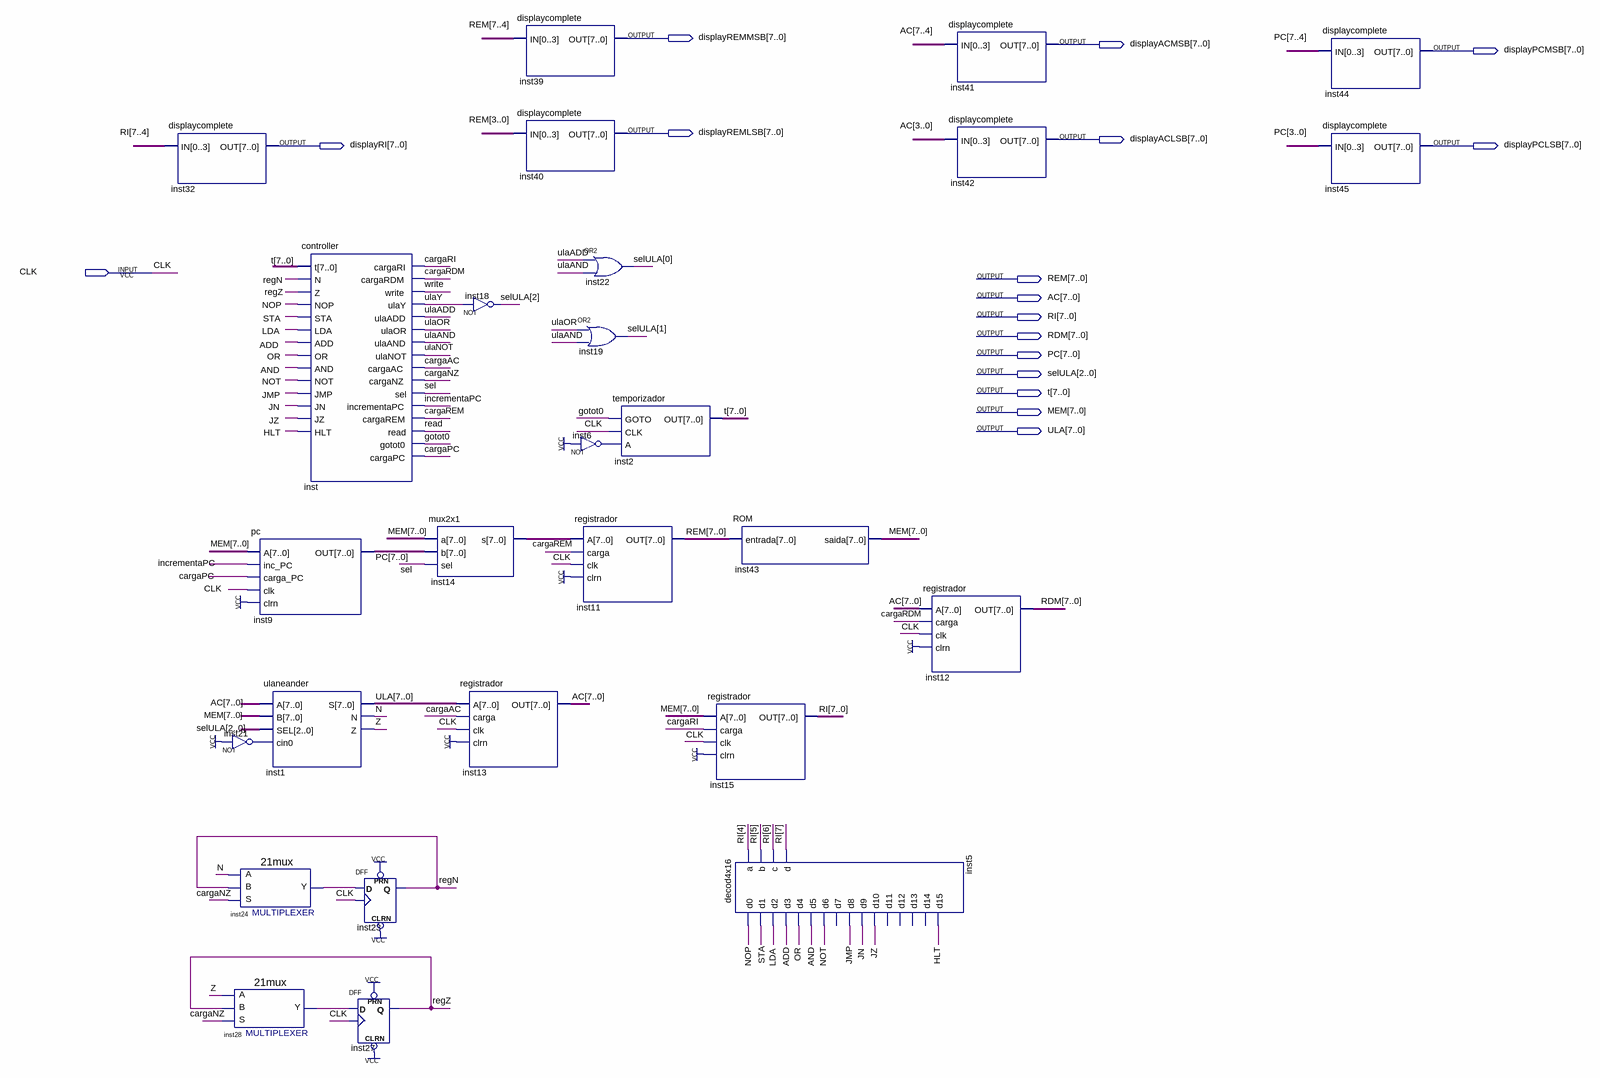
[diagram p0: schematic sheet]
// Quartus schematic neander.bdf as structural Verilog: 27 symbols, 17 pins
module neander (
  input  CLK,
  output [7:0] displayREMMSB,
  output [7:0] displayACMSB,
  output [7:0] displayPCMSB,
  output [7:0] displayREMLSB,
  output [7:0] displayACLSB,
  output [7:0] displayRI,
  output [7:0] displayPCLSB,
  output [7:0] REM,
  output [7:0] AC,
  output [7:0] RI,
  output [7:0] RDM,
  output [7:0] PC,
  output [2:0] selULA,
  output [7:0] t,
  output [7:0] MEM,
  output [7:0] ULA
);

  wire ADD, AND, cargaAC, cargaNZ, cargaPC, cargaRDM, cargaREM, cargaRI, gotot0, HLT, incrementaPC,
       inst6_out, inst21_out, inst24_y, inst28_y, JMP, JN, JZ, LDA, N, NOP, NOT, OR, read, regN, regZ, sel,
       STA, ulaADD, ulaAND, ulaNOT, ulaOR, ulaY, write, Z;
  wire [7:0] inst14_s;

  displaycomplete inst32 (.IN(RI[7:4]), .OUT(displayRI));
  pc inst9 (.A(MEM), .inc_PC(incrementaPC), .carga_PC(cargaPC), .clk(CLK), .clrn(1'b1), .OUT(PC));
  not inst21 (inst21_out, 1'b1);
  \21mux  inst24 (.S(cargaNZ), .B(regN), .A(N), .Y(inst24_y));
  \21mux  inst28 (.S(cargaNZ), .B(regZ), .A(Z), .Y(inst28_y));
  controller inst (
    .t(t), .N(regN), .Z(regZ), .NOP(NOP), .STA(STA), .LDA(LDA), .ADD(ADD), .OR(OR), .AND(AND), .NOT(NOT),
    .JMP(JMP), .JN(JN), .JZ(JZ), .HLT(HLT), .cargaRI(cargaRI), .cargaRDM(cargaRDM), .write(write),
    .ulaY(ulaY), .ulaADD(ulaADD), .ulaOR(ulaOR), .ulaAND(ulaAND), .ulaNOT(ulaNOT), .cargaAC(cargaAC),
    .cargaNZ(cargaNZ), .sel(sel), .incrementaPC(incrementaPC), .cargaREM(cargaREM), .read(read),
    .gotot0(gotot0), .cargaPC(cargaPC));
  ulaneander inst1 (.A(AC), .B(MEM), .SEL(selULA), .cin0(inst21_out), .S(ULA), .N(N), .Z(Z));
  DFF inst27 (.CLRN(1'b1), .CLK(CLK), .D(inst28_y), .PRN(1'b1), .Q(regZ));
  DFF inst23 (.CLRN(1'b1), .CLK(CLK), .D(inst24_y), .PRN(1'b1), .Q(regN));
  mux2x1 inst14 (.a(MEM), .b(PC), .sel(sel), .s(inst14_s));
  not inst18 (selULA[2], ulaY);
  registrador inst13 (.A(ULA), .carga(cargaAC), .clk(CLK), .clrn(1'b1), .OUT(AC));
  displaycomplete inst39 (.IN(REM[7:4]), .OUT(displayREMMSB));
  displaycomplete inst40 (.IN(REM[3:0]), .OUT(displayREMLSB));
  or inst22 (selULA[0], ulaADD, ulaAND);
  or inst19 (selULA[1], ulaOR, ulaAND);
  not inst6 (inst6_out, 1'b1);
  registrador inst11 (.A(inst14_s), .carga(cargaREM), .clk(CLK), .clrn(1'b1), .OUT(REM));
  temporizador inst2 (.GOTO(gotot0), .CLK(CLK), .A(inst6_out), .OUT(t));
  registrador inst15 (.A(MEM), .carga(cargaRI), .clk(CLK), .clrn(1'b1), .OUT(RI));
  ROM inst43 (.entrada(REM), .saida(MEM));
  decod4x16 inst5 (
    .a(RI[4]), .b(RI[5]), .c(RI[6]), .d(RI[7]), .d0(NOP), .d1(STA), .d2(LDA), .d3(ADD), .d4(OR), .d5(AND),
    .d6(NOT), .d8(JMP), .d9(JN), .d10(JZ), .d15(HLT));  // open: d7, d11, d12, d13, d14
  displaycomplete inst41 (.IN(AC[7:4]), .OUT(displayACMSB));
  displaycomplete inst42 (.IN(AC[3:0]), .OUT(displayACLSB));
  registrador inst12 (.A(AC), .carga(cargaRDM), .clk(CLK), .clrn(1'b1), .OUT(RDM));
  displaycomplete inst44 (.IN(PC[7:4]), .OUT(displayPCMSB));
  displaycomplete inst45 (.IN(PC[3:0]), .OUT(displayPCLSB));
endmodule
